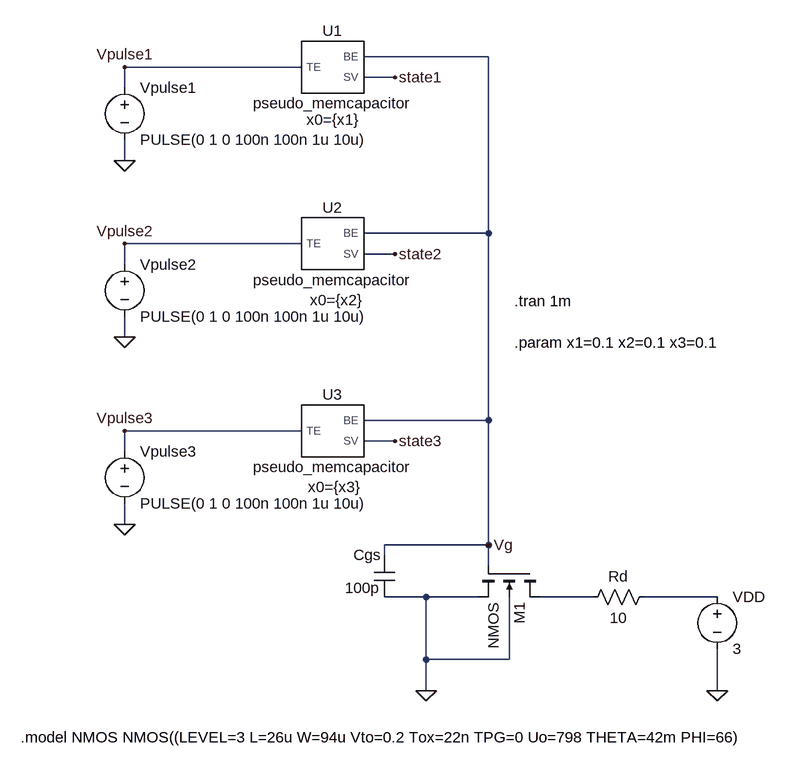
[diagram p0: schematic neuro_memristor_3x1.asc]
neuro_memristor_3x1.asc, the LTspice schematic file:
Version 4
SHEET 1 1936 960
WIRE 704 -176 512 -176
WIRE 416 -160 144 -160
WIRE 560 -144 512 -144
WIRE 144 -128 144 -160
WIRE 144 -16 144 -48
WIRE 704 96 704 -176
WIRE 704 96 512 96
WIRE 416 112 144 112
WIRE 560 128 512 128
WIRE 144 144 144 112
WIRE 144 256 144 224
WIRE 704 384 704 96
WIRE 704 384 512 384
WIRE 416 400 144 400
WIRE 560 416 512 416
WIRE 144 432 144 400
WIRE 144 544 144 512
WIRE 704 576 704 384
WIRE 704 576 544 576
WIRE 544 592 544 576
WIRE 704 608 704 576
WIRE 608 656 544 656
WIRE 688 656 608 656
WIRE 864 656 784 656
WIRE 1056 656 944 656
WIRE 608 752 608 656
WIRE 736 752 736 656
WIRE 736 752 608 752
WIRE 608 800 608 752
WIRE 1056 800 1056 736
FLAG 144 -16 0
FLAG 1056 800 0
FLAG 608 800 0
FLAG 560 -144 state1
FLAG 704 576 Vg
FLAG 144 -160 Vpulse1
FLAG 560 128 state2
FLAG 560 416 state3
FLAG 144 256 0
FLAG 144 544 0
FLAG 144 112 Vpulse2
FLAG 144 400 Vpulse3
SYMBOL voltage 144 -144 R0
WINDOW 123 0 0 Left 0
WINDOW 39 0 0 Left 0
SYMATTR InstName Vpulse1
SYMATTR Value PULSE(0 1 0 100n 100n 1u 10u)
SYMBOL voltage 1056 640 R0
SYMATTR InstName VDD
SYMATTR Value 3
SYMBOL nmos4 784 608 R90
SYMATTR InstName M1
SYMBOL pseudo_memcapacitor 464 -160 R0
WINDOW 123 1 97 Bottom 2
SYMATTR Value2 x0={x1}
SYMATTR InstName U1
SYMBOL cap 528 592 R0
WINDOW 0 -32 -1 Left 2
WINDOW 3 -45 50 Left 2
SYMATTR InstName Cgs
SYMATTR Value 100p
SYMBOL pseudo_memcapacitor 464 112 R0
WINDOW 123 6 71 Top 2
SYMATTR Value2 x0={x2}
SYMATTR InstName U2
SYMBOL pseudo_memcapacitor 464 400 R0
WINDOW 123 3 71 Top 2
SYMATTR Value2 x0={x3}
SYMATTR InstName U3
SYMBOL voltage 144 128 R0
WINDOW 123 0 0 Left 0
WINDOW 39 0 0 Left 0
SYMATTR InstName Vpulse2
SYMATTR Value PULSE(0 1 0 100n 100n 1u 10u)
SYMBOL voltage 144 416 R0
SYMATTR InstName Vpulse3
SYMATTR Value PULSE(0 1 0 100n 100n 1u 10u)
SYMBOL res 960 640 R90
WINDOW 0 0 56 VBottom 2
WINDOW 3 32 56 VTop 2
SYMATTR InstName Rd
SYMATTR Value 10
TEXT 744 200 Left 2 !.tran 1m
TEXT -16 872 Left 2 !.model NMOS NMOS((LEVEL=3 L=26u W=94u Vto=0.2 Tox=22n TPG=0 Uo=798 THETA=42m PHI=66)
TEXT 744 264 Left 2 !.param x1=0.1 x2=0.1 x3=0.1

The netlist it stands for:
* neuro_memristor_3x1.asc
Vpulse1 Vpulse1 0 PULSE(0 1 0 100n 100n 1u 10u)
VDD N002 0 3
M1 N001 Vg 0 0 NMOS
XU1 Vpulse1 Vg state1 pseudo_memcapacitor x0={x1}  ; pins TE BE SV
Cgs Vg 0 100p
XU2 Vpulse2 Vg state2 pseudo_memcapacitor x0={x2}  ; pins TE BE SV
XU3 Vpulse3 Vg state3 pseudo_memcapacitor x0={x3}  ; pins TE BE SV
Vpulse2 Vpulse2 0 PULSE(0 1 0 100n 100n 1u 10u)
Vpulse3 Vpulse3 0 PULSE(0 1 0 100n 100n 1u 10u)
Rd N002 N001 10
.model NMOS NMOS
.model PMOS PMOS
.lib standard.mos
.tran 1m
.model NMOS NMOS((LEVEL=3 L=26u W=94u Vto=0.2 Tox=22n TPG=0 Uo=798 THETA=42m PHI=66)
.param x1=0.1 x2=0.1 x3=0.1
.lib .\pseudo_memcapacitor.cir
.backanno
.end